# Altium schematic sheet SAMD21.SchDoc
size A; SheetNumber: 1; SheetTotal: 2
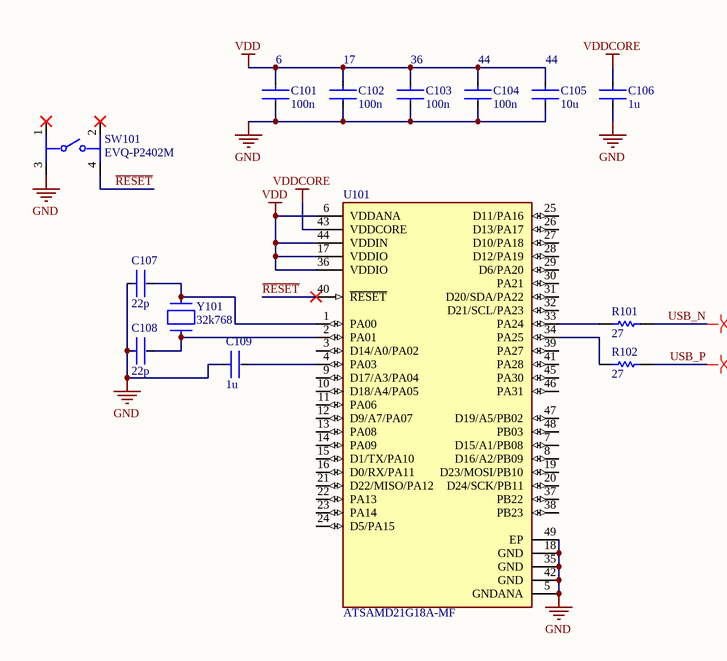
[diagram p0: SAMD21.SchDoc]

## Parts
C101  100n  [FP-GCM155-0_05-MFG]
C102  100n  [FP-GCM155-0_05-MFG]
C103  100n  [FP-GCM155-0_05-MFG]
C104  100n  [FP-GCM155-0_05-MFG]
C105  10u  [FP-GRT31C-0_2-IPC_C]
C106  1u  [FP-GRM155-0_1-MFG]
C107  22p  [FP-GRT155-0_05-MFG]
C108  22p  [FP-GRT155-0_05-MFG]
C109  1u  [FP-GRM155-0_1-MFG]
R101  27  [RESC1005X04N]
R102  27  [RESC1005X04N]
SW101  EVQ-P2402M  [EVQ-P2402M]
U101  ATSAMD21G18A-MF  [QFN-48]
Y101  32k768  [ABS05W-32.768KHZ-D-2-T]

## Nets
GND: C101.2 C102.2 C103.2 C104.2 C105.2 C106.2 C107.1 C108.1 C109.1 SW101.3 U101.5(GNDANA) U101.18(GND) U101.35(GND) U101.42(GND) U101.49(EP)
VDD: C101.1 C102.1 C103.1 C104.1 C105.1 U101.6(VDDANA) U101.17(VDDIO) U101.36(VDDIO) U101.44(VDDIN)
VDDCORE: C106.1 U101.43(VDDCORE)
~{RESET}: SW101.4 U101.40(~{RESET})
USB_N: R101.2
USB_P: R102.2
NetC107_2: C107.2 U101.1(PA00) Y101.2
NetC108_2: C108.2 U101.2(PA01) Y101.1
NetC109_2: C109.2 U101.4(PA03)
NetR101_1: R101.1 U101.33(PA24)
NetR102_1: R102.1 U101.34(PA25)

Not connected (* = marked no-connect by the designer): SW101 1* 2*; U101 3(D14/A0/PA02) 7(D15/A1/PB08) 8(D16/A2/PB09) 9(D17/A3/PA04) 10(D18/A4/PA05) 11(PA06) 12(D9/A7/PA07) 13(PA08) 14(PA09) 15(D1/TX/PA10) 16(D0/RX/PA11) 19(D23/MOSI/PB10) 20(D24/SCK/PB11) 21(D22/MISO/PA12) 22(PA13) 23(PA14) 24(D5/PA15) 25(D11/PA16) 26(D13/PA17) 27(D10/PA18) 28(D12/PA19) 29(D6/PA20) 30(PA21) 31(D20/SDA/PA22) 32(D21/SCL/PA23) 37(PB22) 38(PB23) 39(PA27) 41(PA28) 45(PA30) 46(PA31) 47(D19/A5/PB02) 48(PB03)

## Layout directives
differential pair: USB_N, USB_P

## Notes on the sheet
- (near C101) 6
- (near C102) 17
- (near C103) 36
- (near C104) 44
- (near C105) 44

## Library data of the parts
C101-C104 = GCM155R71H104KE02J: Ceramic Capacitor for Automotive 100nF ±10% 50VDC X7R 0402 Paper T/R; Voltage Rating (DC): 50V; Case Code (Metric): 1005; Dielectric: X7R; Capacitance: 100nF; Packaging: Tape and Reel; Min Operating Temperature: -55°C; Length: 0.039inch; Thickness: 0.022inch; Height: 0.5mm; Mount: Surface Mount; Termination: SMD/SMT; Voltage Rating: 50V; Package Quantity: 50000; Width: 0.02inch; Case/Package: 0402; Case Code (Imperial): 0402; Ratings: AEC-Q200; Max Operating Temperature: 125°C; Tolerance: 10%; Weight: 0.000212oz; Supplier 1: Digi-Key; Supplier Part Number 1: 490-14514-1-ND
C105 = GRT31CR61H106ME01L: CAP CER 10UF 50V X5R 1206; Tolerance: 20%; Length: 0.126inch; Mount: Surface Mount; Packaging: Tape and Reel; Capacitance: 10uF; Case/Package: 1206; Case Code (Imperial): 1206; Max Operating Temperature: 85°C; Voltage Rating: 50V; Ratings: AEC-Q200; Min Operating Temperature: -55°C; Thickness: 0.071inch; Width: 0.063inch; Case Code (Metric): 3216; Supplier 1: Digi-Key; Supplier Part Number 1: 490-12457-1-ND
C106 C109 = GRM155R61H105ME05D: Chip Multilayer Ceramic Capacitors for General Purpose, 0402, 1.0uF, X5R, 15%, 20%, 50V; Supplier 1: Digi-Key; Supplier Part Number 1: 490-GRM155R61H105ME05DTR-ND
C107 C108 = GRT1555C1E220JA02D: Multi-Layer Ceramic Capacitor 22pF 25V C0G ±5% 0402 Paper T/R; Supplier 1: Mouser; Supplier Part Number 1: 81-GRT1555C1E220JA2D
R101 R102 = ERJ2RKF27R0X: Manufacturer: Panasonic; Part Number: ERJ2RKF27R0X; Supplier 1: Newark; Supplier Part Number 1: 85Y8229
U101 = ATSAMD21G18A-MF: Feather M0; Supplier 1: Newark; Supplier Part Number 1: 26Y6922
Y101 = ABS05W-32.768KHZ-D-2-T: Crystal Oscillator; Supplier 1: Digi-Key; Supplier Part Number 1: 535-14310-1-ND
SW101 = EVQ-P2402M: Supplier 1: Digi-Key; Supplier Part Number 1: P11080SCT-ND